# EAGLE schematic smart_home_demo (EAGLE 6.6.0)
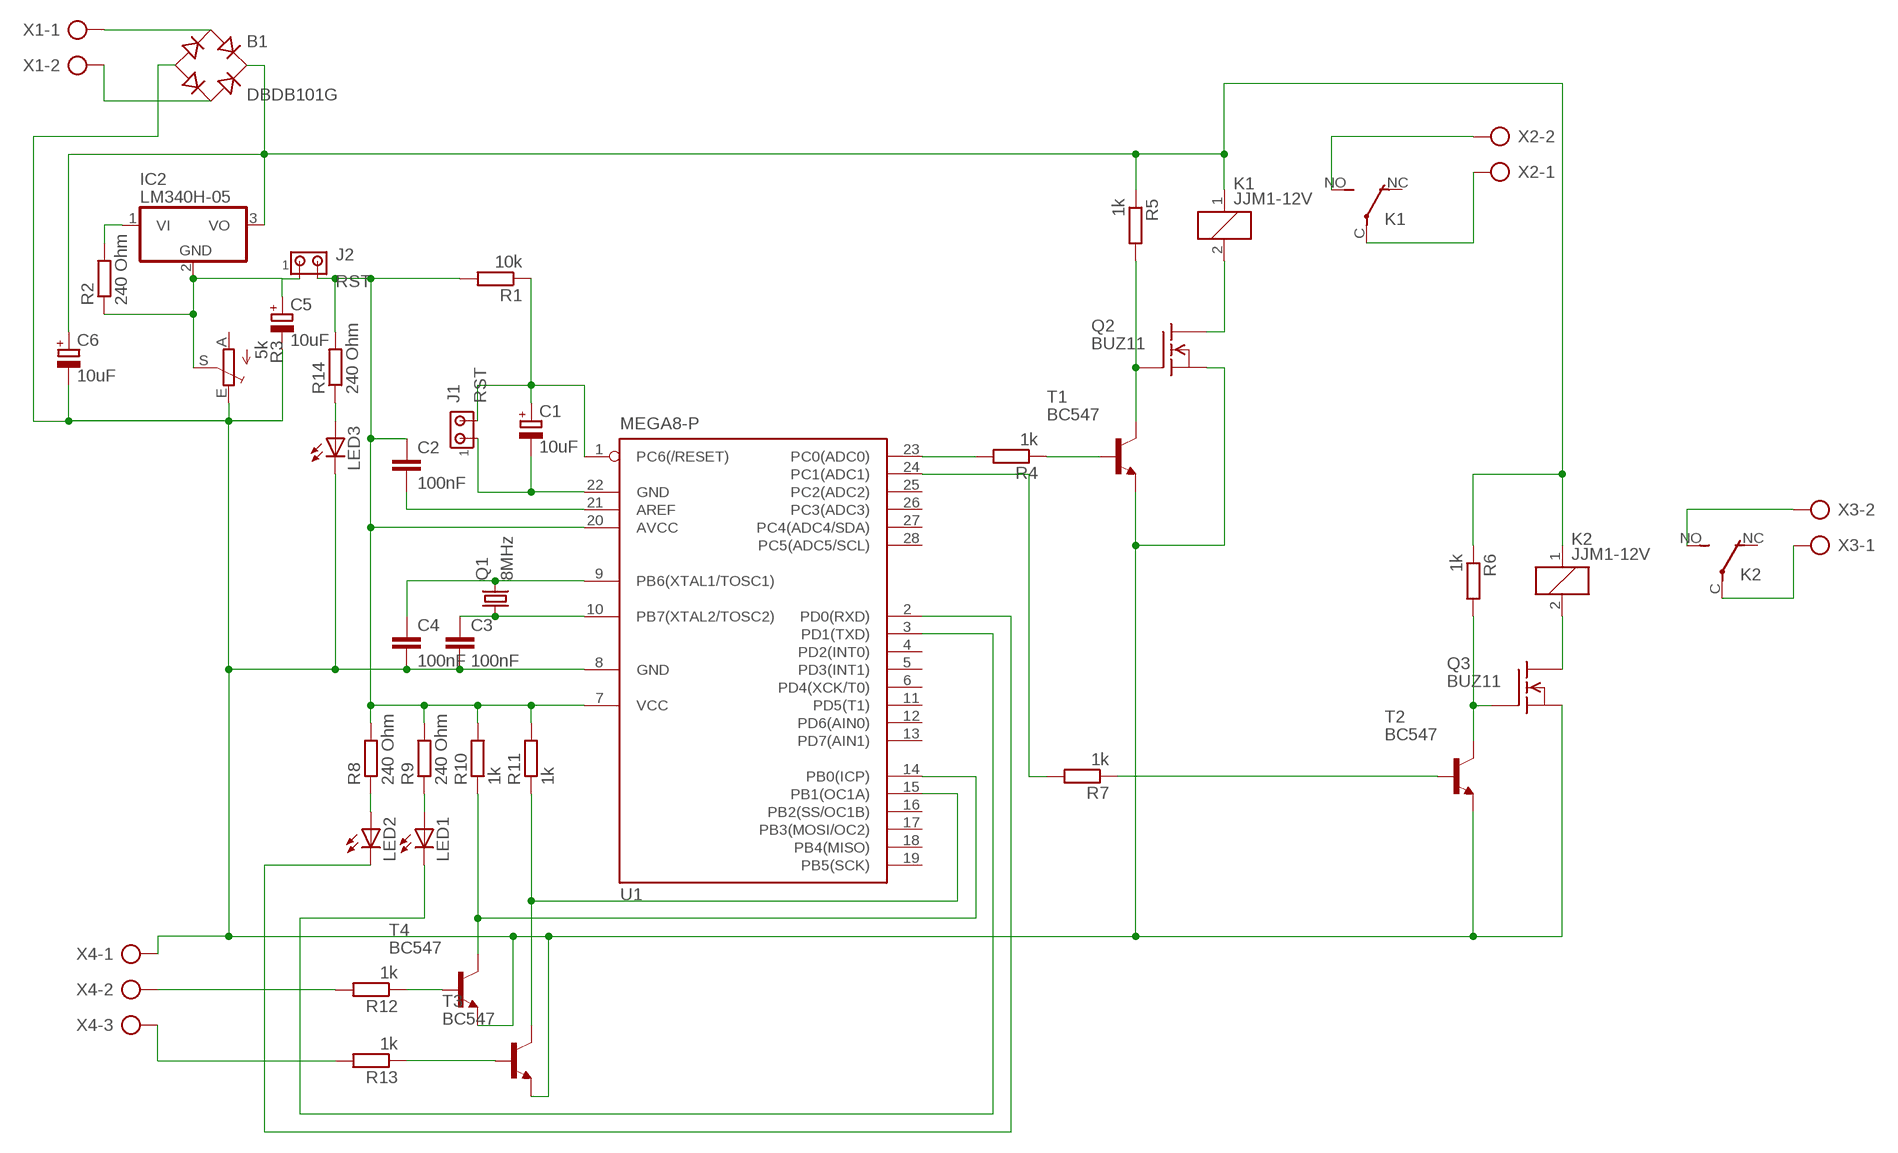
[diagram p0: schematic, sheet 1]

## Parts
B1  DBDB101G  [DB]
C1  10uF  CPOL-EUE2.5-7  [E2,5-7]
C2  100nF  C-EUC1206K  [C1206K]
C3  100nF  C-EUC1206K  [C1206K]
C4  100nF  C-EUC1206K  [C1206K]
C5  10uF  CPOL-EUE2.5-7  [E2,5-7]
C6  10uF  CPOL-EUE2.5-7  [E2,5-7]
IC2  LM340H-05  [TO220H]
J1  RST  MTA02-100  [10X02MTA]
J2  RST  MTA02-100  [10X02MTA]
K1  JJM1-12V  [JJM1C]
K2  JJM1-12V  [JJM1C]
LED1  LED5MM  [LED5MM]
LED2  LED5MM  [LED5MM]
LED3  LED5MM  [LED5MM]
Q1  8MHz  MC-405  [MC-405]
Q2  BUZ11  [TO220]
Q3  BUZ11  [TO220]
R1  10k  R-EU_R1206  [R1206]
R2  240 Ohm  R-EU_R1206  [R1206]
R3  5k  TRIM_EU-CA6V  [CA6V]
R4  1k  R-EU_R1206  [R1206]
R5  1k  R-EU_R1206  [R1206]
R6  1k  R-EU_R1206  [R1206]
R7  1k  R-EU_R1206  [R1206]
R8  240 Ohm  R-EU_R1206  [R1206]
R9  240 Ohm  R-EU_R1206  [R1206]
R10  1k  R-EU_R1206  [R1206]
R11  1k  R-EU_R1206  [R1206]
R12  1k  R-EU_R1206  [R1206]
R13  1k  R-EU_R1206  [R1206]
R14  240 Ohm  R-EU_R1206  [R1206]
T1  BC547  [TO92]
T2  BC547  [TO92]
T3  BC547  [TO92]
T4  BC547  [TO92]
U1  MEGA8-P  [DIL28-3]
X1  AK300/2  [AK300/2]
X2  AK300/2  [AK300/2]
X3  AK300/2  [AK300/2]
X4  AK300/3  [AK300/3]

## Nets
N$1: C1.- J1.1 U1.22(GND)
N$2: C1.+ J1.2 R1.1 U1.1(PC6(/RESET))
N$3: C2.2 U1.21(AREF)
N$4: C2.1 J2.2 R1.2 R8.2 R9.2 R10.2 R11.2 R14.2 U1.7(VCC) U1.20(AVCC)
N$5: B1.- C3.2 C4.2 C5.- C6.- LED3.K(C) Q2.3(S) Q3.3(S) R3.E T1.1(E) T2.1(E) T3.1(E) T4.1(E) U1.8(GND) X4.1
N$6: C4.1 Q1.2 U1.9(PB6(XTAL1/TOSC1))
N$7: C3.1 Q1.1 U1.10(PB7(XTAL2/TOSC2))
N$8: C5.+ IC2.2(GND) J2.1 R2.1 R3.S
N$9: B1.AC1 X1.1
N$10: B1.AC2 X1.2
N$11: R7.1 T2.2(B)
N$12: IC2.1(VI) R2.2
N$13: R4.2 U1.23(PC0(ADC0))
N$14: R4.1 T1.2(B)
N$15: Q2.1(G) R5.2 T1.3(C)
N$16: B1.+ C6.+ IC2.3(VO) K1.1 K2.1 R5.1 R6.1
N$17: K1.2 Q2.2(D)
N$18: R7.2 U1.24(PC1(ADC1))
N$19: K1.C(2:P) X2.1
N$20: K1.NO(2:S) X2.2
N$21: K2.C(2:P) X3.1
N$22: K2.NO(2:S) X3.2
N$23: Q3.1(G) R6.2 T2.3(C)
N$24: K2.2 Q3.2(D)
N$25: LED2.A R8.1
N$26: LED1.A R9.1
N$27: R10.1 T4.3(C) U1.14(PB0(ICP))
N$28: R11.1 T3.3(C) U1.15(PB1(OC1A))
N$29: R12.1 T4.2(B)
N$30: R13.1 T3.2(B)
N$32: R12.2 X4.2
N$33: R13.2 X4.3
N$34: LED1.K(C) U1.3(PD1(TXD))
N$35: LED2.K(C) U1.2(PD0(RXD))
N$36: LED3.A R14.1
Unconnected: K1.NC(2:O) K2.NC(2:O) R3.A U1.4(PD2(INT0)) U1.5(PD3(INT1)) U1.6(PD4(XCK/T0)) U1.11(PD5(T1)) U1.12(PD6(AIN0)) U1.13(PD7(AIN1)) U1.16(PB2(SS/OC1B)) U1.17(PB3(MOSI/OC2)) U1.18(PB4(MISO)) U1.19(PB5(SCK)) U1.25(PC2(ADC2)) U1.26(PC3(ADC3)) U1.27(PC4(ADC4/SDA)) U1.28(PC5(ADC5/SCL))

## Library data of the parts
B1 = rectifier:DB?*G: Single Phase 1.0 AMP Glass Passivated Bridge Rectifier Taiwan Semiconductor Co.,Ltd. - TSC Source: http://www.taiwansemi.com/TSCbig5/ezcatfiles/cust/img/img/db101g.pdf http://www.ts.com.tw/db/pictures/modules/PDT/PDT060207001/DBLS201G.pdf
C1 C5 C6 = rcl:CPOL-EU: POLARIZED CAPACITOR, European symbol
C2-C4 = rcl:C-EU: CAPACITOR, European symbol
IC2 = linear:LM340?-*: Positive VOLTAGE REGULATOR Source: http://cache.national.com/ds/LM/LM340.pdf
J1 J2 = con-amp:MTA02-100: AMP connector
K1 K2 = relay:JJM1-12V: HALF-SIZE AUTOMOTIVE RELAY NAiS Source: http://www.mew-europe.com/.. en_ds_61210_0001.pdf; MF: AROMAT/ MATSUSHITA; MPN: JJM1-12V; OC_FARNELL: unknown; OC_NEWARK: 10C7318
LED1-LED3 = led:LED: LED OSRAM: - CHIPLED LG R971, LG N971, LY N971, LG Q971, LY Q971, LO R971, LY R971 LH N974, LH R974 LS Q976, LO Q976, LY Q976 LO Q996 - Hyper CHIPLED LW Q18S LB Q993, LB Q99A, LB R99A - SideLED LS A670, LO A670, LY A670, LG A670, LP A670 LB A673, LV A673, LT A673, LW A673 LH A674 LY A675 LS A676, LA A676, LO A676, LY A676, LW A676 LS A679, LY A679, LG A679 - Hyper Micro SIDELED® LS Y876, LA Y876, LO Y876, LY Y876 LT Y87S - SmartLED LW L88C, LW L88S LB L89C, LB L89S, LG L890 LS L89K, LO L89K, LY L89K LS L896, LA L896, LO L896, LY L896 - TOPLED LS T670, LO T670, LY T670, LG T670, LP T670 LSG T670, LSP T670, LSY T670, LOP T670, LYG T670 LG T671, LOG T671, LSG T671 LB T673, LV T673, LT T673, LW T673 LH T674 LS T676, LA T676, LO T676, LY T676, LB T676, LH T676, LSB T676, LW T676 LB T67C, LV T67C, LT T67C, LS T67K, LO T67K, LY T67K, LW E67C LS E67B, LA E67B, LO E67B, LY E67B, LB E67C, LV E67C, LT E67C LW T67C LS T679, LY T679, LG T679 LS T770, LO T770, LY T770, LG T770, LP T770 LB T773, LV T773, LT T773, LW T773 LH T774 LS E675, LA E675, LY E675, LS T675 LS T776, LA T776, LO T776, LY T776, LB T776 LHGB T686 LT T68C, LB T68C - Hyper Mini TOPLED® LB M676 - Mini TOPLED Santana® LG M470 LS M47K, LO M47K, LY M47K Source: http://www.osram.convergy.de LUXEON: - LUMILED® LXK2-PW12-R00, LXK2-PW12-S00, LXK2-PW14-U00, LXK2-PW14-V00 LXK2-PM12-R00, LXK2-PM12-S00, LXK2-PM14-U00 LXK2-PE12-Q00, LXK2-PE12-R00, LXK2-PE12-S00, LXK2-PE14-T00, LXK2-PE14-U00 LXK2-PB12-K00, LXK2-PB12-L00, LXK2-PB12-M00, LXK2-PB14-N00, LXK2-PB14-P00, LXK2-PB14-Q00 LXK2-PR12-L00, LXK2-PR12-M00, LXK2-PR14-Q00, LXK2-PR14-R00 LXK2-PD12-Q00, LXK2-PD12-R00, LXK2-PD12-S00 LXK2-PH12-R00, LXK2-PH12-S00 LXK2-PL12-P00, LXK2-PL12-Q00, LXK2-PL12-R00 Source: www.luxeon.com KINGBRIGHT: KA-3528ASYC Source: www.kingbright.com
Q1 = crystal:MC-405: kHz RANGE CRYSTAL UNIT SMD Source: MC-306_405_406_E07X.PDF Homepage <http://www.epsontoyocom.co.jp>; OC_FARNELL: unknown; OC_NEWARK: unknown
Q2 Q3 = transistor-fet:BUZ11: N-Channel Enhancement MOSFET 50V; 30A; 0,040Ohm
R1 R2 R4-R14 = rcl:R-EU_: RESISTOR, European symbol
R3 = pot:TRIM_EU-: POTENTIOMETER
T1-T4 = transistor:BC547: NPN TRANSISTOR
U1 = atmel:MEGA8-P: MICROCONTROLLER 8 Kbytes FLASH, 1 kbytes SRAM, 512 bytes EEPROM, USART, 4-channel 10 bit ADC, 2-channel 8 bit ADC Pin compatible with Atmega48, ATMega88, ATMega168 Source: avr.lbr; OC_FARNELL: unknown; OC_NEWARK: unknown
X1-X3 = con-ptr500:AK300/2: CONNECTOR; OC_FARNELL: unknown; OC_NEWARK: unknown
X4 = con-ptr500:AK300/3: CONNECTOR; OC_FARNELL: unknown; OC_NEWARK: unknown